# EAGLE design hamp2 (EAGLE 6.1)
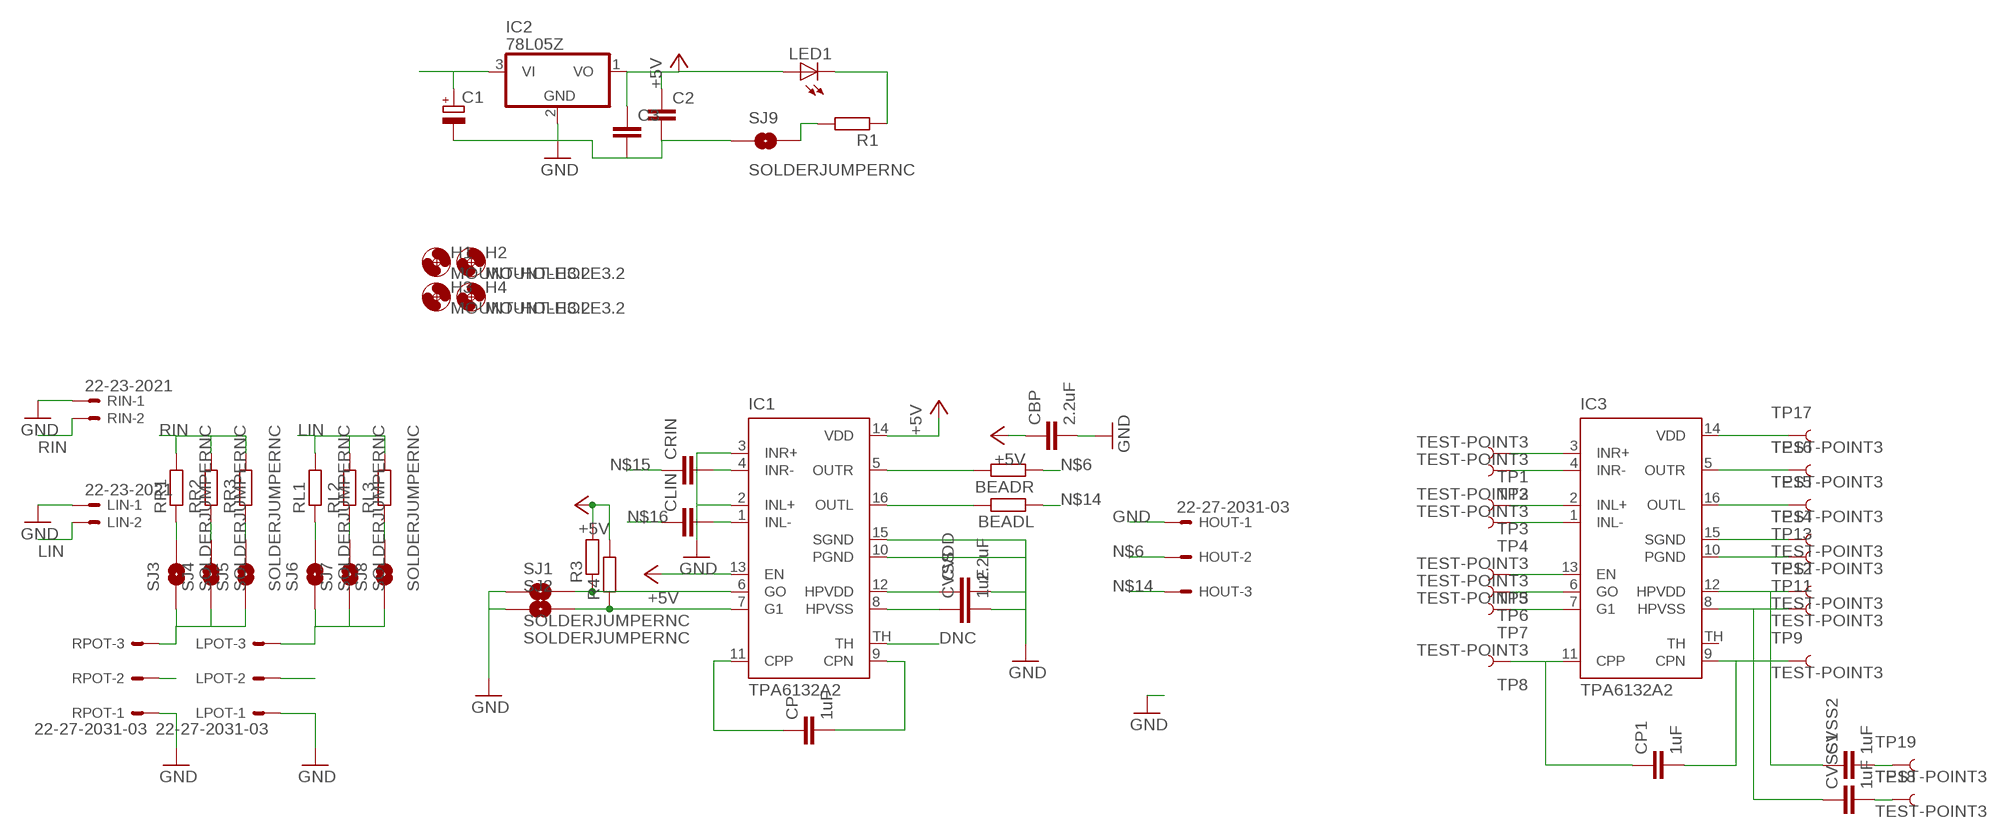
[diagram p0: schematic, sheet 1]

## Parts
BEADL  R-EU_R0805  [R0805]
BEADR  R-EU_R0805  [R0805]
C1  CPOL-EUF  [PANASONIC_F]
C2  C-EUC1210  [C1210]
C3  C-EUC0805  [C0805]
CBP  2.2uF  C-EUC0805  [C0805]
CLIN  C-EU050-055X075  [C050-055X075]
CP  1uF  C-EUC0805  [C0805]
CP1  1uF  C-EUC0805  [C0805]
CRIN  C-EU050-055X075  [C050-055X075]
CVDD  2.2uF  C-EUC0805  [C0805]
CVSS  1uF  C-EUC0805  [C0805]
CVSS1  1uF  C-EUC0805  [C0805]
CVSS2  1uF  C-EUC0805  [C0805]
H1  MOUNT-HOLE3.2  [3,2]
H2  MOUNT-HOLE3.2  [3,2]
H3  MOUNT-HOLE3.2  [3,2]
H4  MOUNT-HOLE3.2  [3,2]
HOUT  22-27-2031-03  [6410-03]
IC1  TPA6132A2  [QFN16]
IC2  78L05Z  [TO92]
IC3  TPA6132A2  [QFN16]
LED1  LEDCHIP-LED0805  [CHIP-LED0805]
LIN  22-23-2021  [22-23-2021]
LPOT  22-27-2031-03  [6410-03]
R1  R-EU_R0805  [R0805]
R3  R-EU_R0805  [R0805]
R4  R-EU_R0805  [R0805]
RIN  22-23-2021  [22-23-2021]
RL1  R-EU_R0805  [R0805]
RL2  R-EU_R0805  [R0805]
RL3  R-EU_R0805  [R0805]
RPOT  22-27-2031-03  [6410-03]
RR1  R-EU_R0805  [R0805]
RR2  R-EU_R0805  [R0805]
RR3  R-EU_R0805  [R0805]
SJ1  SOLDERJUMPERNC  [SJ_2S]
SJ2  SOLDERJUMPERNC  [SJ_2S]
SJ3  SOLDERJUMPERNC  [SJ_2S]
SJ4  SOLDERJUMPERNC  [SJ_2S]
SJ5  SOLDERJUMPERNC  [SJ_2S]
SJ6  SOLDERJUMPERNC  [SJ_2S]
SJ7  SOLDERJUMPERNC  [SJ_2S]
SJ8  SOLDERJUMPERNC  [SJ_2S]
SJ9  SOLDERJUMPERNC  [SJ_2S]
TP1  TEST-POINT3  [PAD.03X.03]
TP2  TEST-POINT3  [PAD.03X.03]
TP3  TEST-POINT3  [PAD.03X.03]
TP4  TEST-POINT3  [PAD.03X.03]
TP5  TEST-POINT3  [PAD.03X.03]
TP6  TEST-POINT3  [PAD.03X.03]
TP7  TEST-POINT3  [PAD.03X.03]
TP8  TEST-POINT3  [PAD.03X.03]
TP9  TEST-POINT3  [PAD.03X.03]
TP11  TEST-POINT3  [PAD.03X.03]
TP12  TEST-POINT3  [PAD.03X.03]
TP13  TEST-POINT3  [PAD.03X.03]
TP14  TEST-POINT3  [PAD.03X.03]
TP15  TEST-POINT3  [PAD.03X.03]
TP16  TEST-POINT3  [PAD.03X.03]
TP17  TEST-POINT3  [PAD.03X.03]
TP18  TEST-POINT3  [PAD.03X.03]
TP19  TEST-POINT3  [PAD.03X.03]

## Nets
+5V: C2.1 C3.1 CBP.1 IC1.13(EN) IC1.14(VDD) IC2.1(VO) LED1.A R3.2 R4.2
DNC: IC1.TH
GND: C1.- C2.2 C3.2 CBP.2 CVDD.2 CVSS.2 HOUT.1 IC1.2(INL+) IC1.3(INR+) IC1.10(PGND) IC1.15(SGND) IC2.2(GND) LIN.1 LPOT.1 RIN.1 RPOT.1 SJ1.1 SJ2.1 SJ9.1
LIN: LIN.2 RL1.2 RL2.2 RL3.2
N$1: CVDD.1 IC1.12(HPVDD)
N$2: CRIN.2 IC1.4(INR-)
N$3: CLIN.2 IC1.1(INL-)
N$4: IC1.6(GO) R3.1 SJ1.2
N$5: IC1.7(G1) R4.1 SJ2.2
N$6: BEADR.1 HOUT.2
N$7: CP.1 IC1.11(CPP)
N$8: CP.2 IC1.9(CPN)
N$9: CVSS.1 IC1.8(HPVSS)
N$10: BEADR.2 IC1.5(OUTR)
N$11: BEADL.2 IC1.16(OUTL)
N$12: RR1.1 SJ3.2
N$13: RR2.1 SJ4.2
N$14: BEADL.1 HOUT.3
N$15: CRIN.1 RPOT.2 RR3.1 SJ5.2
N$16: CLIN.1 LPOT.2 RL3.1 SJ8.2
N$17: C1.+ IC2.3(VI)
N$18: RL1.1 SJ6.2
N$19: RL2.1 SJ7.2
N$20: RPOT.3 SJ3.1 SJ4.1 SJ5.1
N$21: LPOT.3 SJ6.1 SJ7.1 SJ8.1
N$22: IC3.3(INR+) TP1.P$1
N$23: IC3.4(INR-) TP2.P$1
N$24: IC3.2(INL+) TP3.P$1
N$25: IC3.1(INL-) TP4.P$1
N$26: IC3.13(EN) TP5.P$1
N$27: IC3.6(GO) TP6.P$1
N$28: IC3.7(G1) TP7.P$1
N$29: CP1.1 IC3.11(CPP) TP8.P$1
N$30: CP1.2 IC3.9(CPN) TP9.P$1
N$31: LED1.C R1.1
N$32: CVSS1.1 IC3.8(HPVSS) TP11.P$1
N$33: CVSS2.1 IC3.12(HPVDD) TP12.P$1
N$34: IC3.10(PGND) TP13.P$1
N$35: IC3.15(SGND) TP14.P$1
N$36: IC3.16(OUTL) TP15.P$1
N$37: IC3.5(OUTR) TP16.P$1
N$38: IC3.14(VDD) TP17.P$1
N$39: CVSS2.2 TP19.P$1
N$40: CVSS1.2 TP18.P$1
N$41: R1.2 SJ9.2
RIN: RIN.2 RR1.2 RR2.2 RR3.2
Unconnected: IC3.TH

## Library data of the parts
BEADL BEADR R1 R3 R4 RL1-RL3 RR1-RR3 = rcl:R-EU_: RESISTOR, European symbol
C1 = rcl:CPOL-EU: POLARIZED CAPACITOR, European symbol
C2 C3 CBP CP CP1 CVDD CVSS CVSS1 CVSS2 = resistor:C-EU: CAPACITOR, European symbol
CLIN CRIN = rcl:C-EU: CAPACITOR, European symbol
H1-H4 = holes:MOUNT-HOLE: MOUNTING HOLE with drill center marker
HOUT LPOT RPOT = con-molex:22-?-03: CONNECTOR wire to board 2.54 mm (.1 inch) pitch header; OC_FARNELL: unknown; OC_NEWARK: unknown
IC1 IC3 = texas:TPA6132A2: 25-mW DIRECTPATH (TM) STEREO HEADPHONE AMPLIFIER WITH POP SUPPRESSION Source: www.ti.com .. tpa6132a2 direct path stereo $.65.pdf; MPN: TPA6132A2RTET; OC_FARNELL: 1697167; OC_NEWARK: 46P3781
IC2 = adafruit:78*: Positive VOLTAGE REGULATOR Added bigger pads to the TO-92 package
LED1 = adafruit:LED: LED OSRAM: - CHIPLED LG R971, LG N971, LY N971, LG Q971, LY Q971, LO R971, LY R971 LH N974, LH R974 LS Q976, LO Q976, LY Q976 LO Q996 - Hyper CHIPLED LW Q18S LB Q993, LB Q99A, LB R99A - SideLED LS A670, LO A670, LY A670, LG A670, LP A670 LB A673, LV A673, LT A673, LW A673 LH A674 LY A675 LS A676, LA A676, LO A676, LY A676, LW A676 LS A679, LY A679, LG A679 - Hyper Micro SIDELED® LS Y876, LA Y876, LO Y876, LY Y876 LT Y87S - SmartLED LW L88C, LW L88S LB L89C, LB L89S, LG L890 LS L89K, LO L89K, LY L89K LS L896, LA L896, LO L896, LY L896 - TOPLED LS T670, LO T670, LY T670, LG T670, LP T670 LSG T670, LSP T670, LSY T670, LOP T670, LYG T670 LG T671, LOG T671, LSG T671 LB T673, LV T673, LT T673, LW T673 LH T674 LS T676, LA T676, LO T676, LY T676, LB T676, LH T676, LSB T676, LW T676 LB T67C, LV T67C, LT T67C, LS T67K, LO T67K, LY T67K, LW E67C LS E67B, LA E67B, LO E67B, LY E67B, LB E67C, LV E67C, LT E67C LW T67C LS T679, LY T679, LG T679 LS T770, LO T770, LY T770, LG T770, LP T770 LB T773, LV T773, LT T773, LW T773 LH T774 LS E675, LA E675, LY E675, LS T675 LS T776, LA T776, LO T776, LY T776, LB T776 LHGB T686 LT T68C, LB T68C - Hyper Mini TOPLED® LB M676 - Mini TOPLED Santana® LG M470 LS M47K, LO M47K, LY M47K Source: http://www.osram.convergy.de/
LIN RIN = con-molex:22-23-2021: .100" (2.54mm) Center Header - 2 Pin; MF: MOLEX; MPN: 22-23-2021; OC_FARNELL: 1462926; OC_NEWARK: 25C3832
SJ1-SJ9 = SparkFun-Passives:SOLDERJUMPER: Solder Jumper Standard SMD solder jumper. Used to automate production. Two varients : Normally Open and Normally Closed are the same, but have different paste layers. NC will have a large amount of paste and should jumper during reflow.
TP1-TP9 TP11-TP19 = SparkFun-Passives:TEST-POINT: Bare copper test points for troubleshooting or ICT

## Board
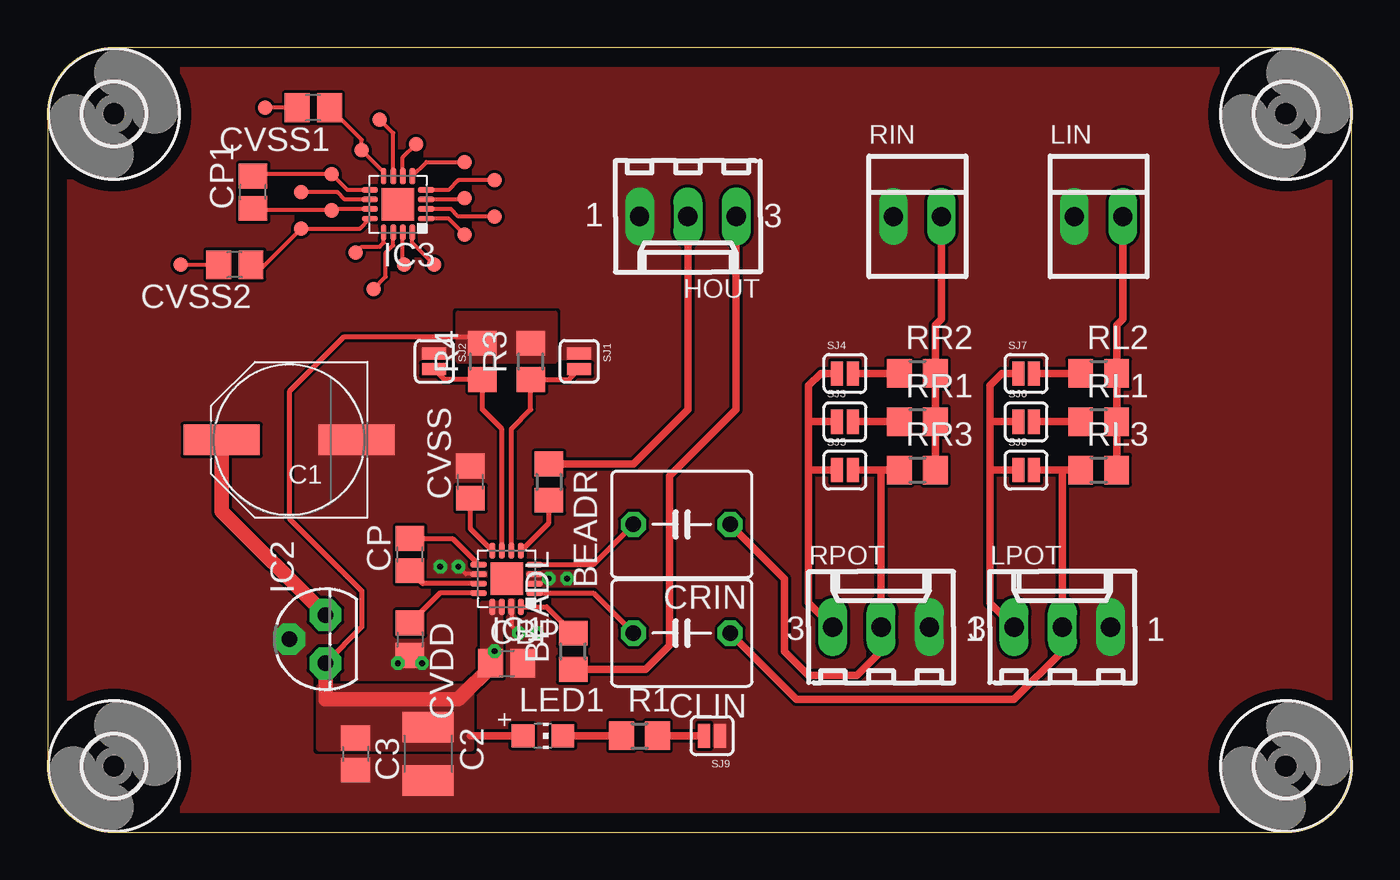
[diagram p1: board, top side]
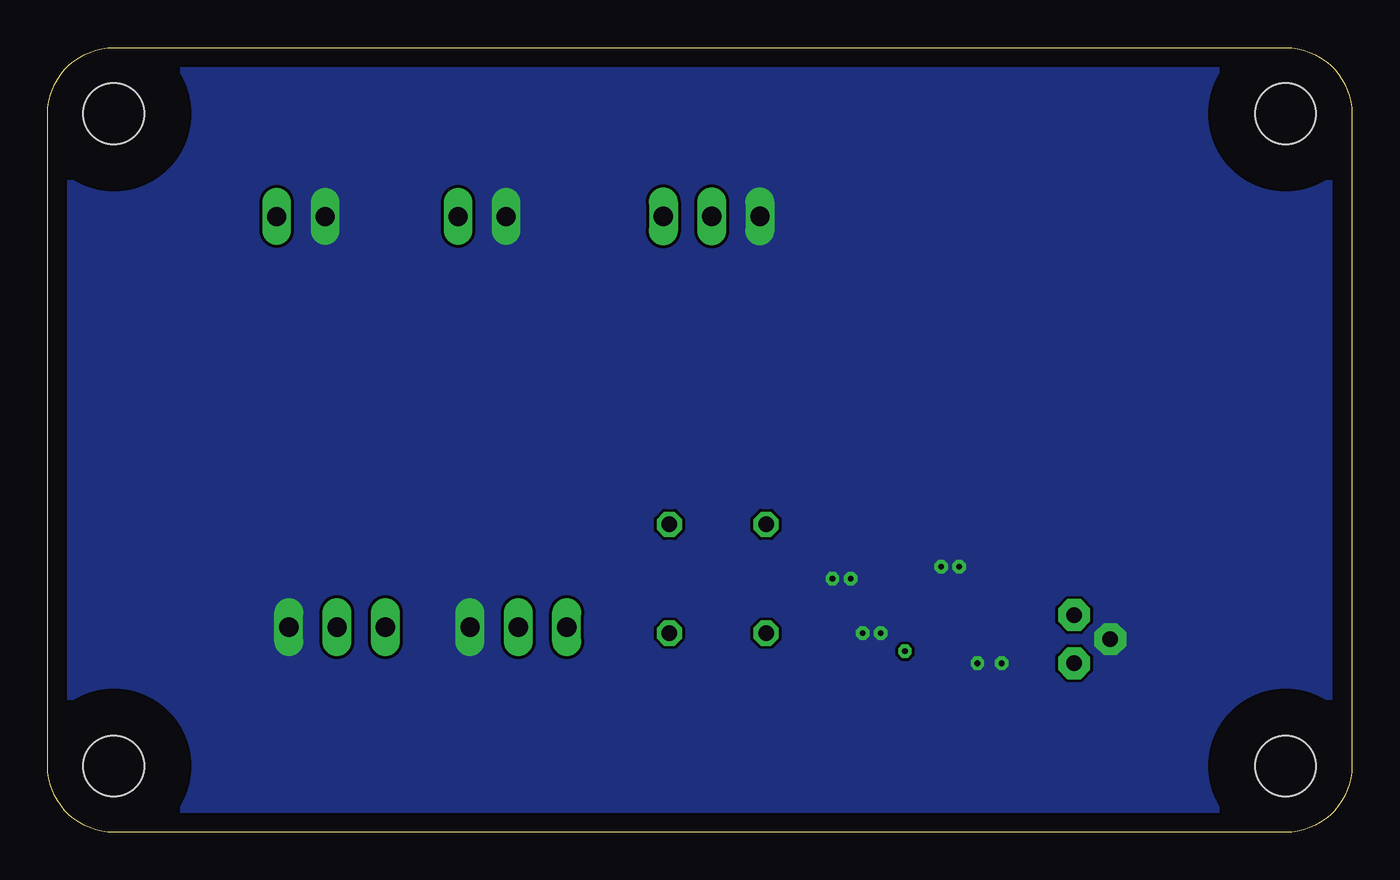
[diagram p2: board, bottom side, seen from below]

Size 68.56 x 41.26 mm. Coordinates in mm from the lower left corner, seen from the top.
Outline: 0,37.77 0,3.49 arc90 3.49,0 65.07,0 arc90 68.56,3.49 68.56,37.77 arc90 65.07,41.26 3.49,41.26 arc90 0,37.77
Copper layers (1*16): Top 0.035mm / dielectric 1.5mm / Bottom 0.035mm
Design rules: minimum track width 8mil, minimum drill 0.3mm, track to track 6mil, track to pad 6mil, pad to pad 6mil, via to via 6mil, smd to smd 0mil, copper to edge 40mil, drill to drill 8mil, minimum pad ring 10mil, minimum via ring 8mil, stop-mask expansion 4mil, vias tented up to drill 0mil, thermal gap 10mil

### Footprints (pad centres in the part's own frame; a part is rotated, then mirrored left to right if it is on the bottom)
R0805 = smd 1.3 x 1.5: 1 -0.95,0; 2 0.95,0
PANASONIC_F = smd 4 x 1.6: + 3.55,0; - -3.55,0
C1210 = smd 1.6 x 2.7: 1 -1.4,0; 2 1.4,0
C0805 = smd 1.3 x 1.5: 1 -0.85,0; 2 0.85,0
C050-055X075 = drill 0.813 octagon: 1 -2.54,0; 2 2.54,0
3,2 = hole 3.2: 0,0
6410-03 = drill 1.016 long: 1 2.54,0; 2 0,0; 3 -2.54,0
QFN16 = smd 0.85 x 0.3: 1 -1.475,0.75; 2 -1.475,0.25; 3 -1.475,-0.25; 4 -1.475,-0.75; 9 1.475,-0.75; 10 1.475,-0.25; 11 1.475,0.25; 12 1.475,0.75 | smd 0.3 x 0.85: 5 -0.75,-1.475; 6 -0.25,-1.475; 7 0.25,-1.475; 8 0.75,-1.475; 13 0.75,1.475; 14 0.25,1.475; 15 -0.25,1.475; 16 -0.75,1.475 | smd 1.7 x 1.7: TH 0,0
TO92 = drill 0.813 pad 1.676 octagon: 1 -1.27,0; 2 0,1.905; 3 1.27,0
CHIP-LED0805 = smd 1.2 x 1.2: A 0,-1.05; C 0,1.05
22-23-2021 = drill 1 long: 1 -1.27,0; 2 1.27,0
SJ_2S = smd 0.635 x 1.27: 1 -0.412,0; 2 0.412,0
PAD.03X.03 = smd 0.762 x 0.762: P$1 0,0

### Placement (x,y rotation side)
BEADL  27.62,9.53 90 top
BEADR  26.35,18.41 270 top
C1  12.7,20.64 180 top
C2  20,4.13 270 top
C3  16.19,4.13 270 top
CBP  24.13,8.89 0 top
CLIN  33.34,10.48 180 top
CP  19.05,14.61 90 top
CP1  10.79,33.66 90 top
CRIN  33.34,16.19 180 top
CVDD  19.05,10.16 270 top
CVSS  22.23,18.41 90 top
CVSS1  13.97,38.1 180 top
CVSS2  9.84,29.84 180 top
H1  3.49,3.49 0 top
H2  3.49,37.78 0 top
H3  65.09,3.49 0 top
H4  65.09,37.78 0 top
HOUT  33.66,32.38 180 top
IC1  24.13,13.34 180 top
IC2  14.61,10.16 90 top
IC3  18.41,33.02 180 top
LED1  26.04,5.08 270 top
LIN  55.24,32.38 0 top
LPOT  53.34,10.79 0 top
R1  31.11,5.08 0 top
R3  25.4,24.77 90 top
R4  22.86,24.77 90 top
RIN  45.72,32.38 0 top
RL1  55.24,21.59 0 top
RL2  55.24,24.13 0 top
RL3  55.24,19.05 0 top
RPOT  43.81,10.79 0 top
RR1  45.72,21.59 0 top
RR2  45.72,24.13 0 top
RR3  45.72,19.05 0 top
SJ1  27.94,24.77 270 top
SJ2  20.32,24.77 270 top
SJ3  41.91,21.59 0 top
SJ4  41.91,24.13 0 top
SJ5  41.91,19.05 0 top
SJ6  51.44,21.59 0 top
SJ7  51.44,24.13 0 top
SJ8  51.44,19.05 0 top
SJ9  34.92,5.08 180 top
TP1  21.91,33.34 90 top
TP2  23.5,34.29 90 top
TP3  23.5,32.38 90 top
TP4  21.91,31.43 90 top
TP5  16.19,30.48 90 top
TP6  19.37,36.2 90 top
TP7  17.46,37.47 90 top
TP8  14.92,32.7 90 top
TP9  14.92,34.61 90 top
TP11  16.51,35.88 90 top
TP12  13.34,31.75 90 top
TP13  13.34,33.66 90 top
TP14  18.73,29.84 90 top
TP15  20.32,29.84 90 top
TP16  21.91,35.24 90 top
TP17  17.14,28.57 90 top
TP18  11.43,38.1 90 top
TP19  6.99,29.84 90 top

### Tracks (layer width: path | path; a pad name or v marks a point on that pad's centre or on a via)
+5V  (via drill 0.3)
  Top 0.254: R4.2 22.86,26.04 15.56,26.04 12.7,23.18 12.7,16.51 16.51,12.7 16.51,10.79 IC2.1
  Top 0.406: LED1.A 22.23,5.08
  Top 0.762: IC2.1 14.61,6.99 21.59,6.99 23.5,8.89
  other vias: 23.5,9.53
  pour Top (no thermals): 23.81,12.06 23.81,8.26 22.86,8.26 22.86,12.06
  pour Top (no thermals): 21.59,27.3 26.67,27.3 26.67,24.77 21.59,24.77
  pour Top (no thermals): 14.29,7.62 22.23,7.62 22.23,4.45 14.29,4.45
GND  (via drill 0.3)
  Top 0.203: IC1.10 21.98,13.59 v21.59,13.97 | IC1.15 24.38,10.86 v24.77,10.48
  other vias: 20.64,13.97 27.3,13.34 26.35,13.34 25.72,10.48 19.68,8.89 18.41,8.89
  pour Top (rank 3, no thermals): 0.64,40.64 67.94,40.64 67.94,0.64 0.64,0.64
  pour Bottom (no thermals): 0.64,41.27 67.94,41.27 67.94,0.64 0.64,0.64
LIN
  Top 0.406: LIN.2 56.52,26.99 56.2,26.67 RL2.2 | RL3.2 RL2.2 | RL2.2 RL1.2
N$1
  Top 0.254: IC1.12 20.62,12.59 CVDD.1
N$2
  Top 0.254: IC1.4 28.69,14.09 CRIN.2
N$3
  Top 0.254: IC1.1 28.69,12.59 CLIN.2
N$4
  Top 0.254: IC1.6 24.38,21.2 25.4,22.23 R3.1 27.4,23.82 SJ1.2
N$5
  Top 0.254: IC1.7 23.88,21.2 22.86,22.23 R4.1 20.86,23.82 SJ2.2
N$6
  Top 0.406: BEADR.1 30.8,19.36 33.66,22.23 HOUT.2
N$7
  Top 0.254: IC1.11 19.72,13.09 CP.1
N$8
  Top 0.254: CP.2 21.29,15.46 IC1.9
N$9
  Top 0.254: IC1.8 22.23,15.96 CVSS.1
N$10
  Top 0.254: IC1.5 26.35,16.28 BEADR.2
N$11
  Top 0.254: IC1.16 26.24,11.86 BEADL.2
N$12
  Top 0.406: RR1.1 SJ3.2
N$13
  Top 0.406: RR2.1 SJ4.2
N$14
  Top 0.406: BEADL.1 31.43,8.57 32.7,9.84 32.7,18.73 36.2,22.23 HOUT.3
N$15
  Top 0.406: RR3.1 43.81,19.05 | 43.81,19.05 SJ5.2 | 43.81,19.05 RPOT.2 43.81,9.53 42.55,8.26 40.01,8.26 38.73,9.53 38.73,13.34 CRIN.1
N$16
  Top 0.406: RL3.1 53.34,19.05 | 53.34,19.05 SJ8.2 | 53.34,19.05 LPOT.2 53.34,9.53 50.8,6.99 39.37,6.99 CLIN.1
N$17
  Top 0.762: C1.+ 9.15,16.89 IC2.3
N$18
  Top 0.406: RL1.1 SJ6.2
N$19
  Top 0.406: RL2.1 SJ7.2
N$20
  Top 0.406: SJ4.1 40.64,24.13 40.01,23.5 40.01,21.59 | 40.01,21.59 40.01,19.05 | SJ3.1 40.01,21.59 | SJ5.1 40.01,19.05 | RPOT.3 40.01,12.06 40.01,19.05
N$21
  Top 0.406: SJ7.1 50.16,24.13 49.53,23.5 49.53,21.59 | 49.53,21.59 49.53,19.05 | SJ6.1 49.53,21.59 | SJ8.1 49.53,19.05 | LPOT.3 49.53,12.06 49.53,19.05
N$22
  Top 0.203: TP1.P$1 21.84,33.27 IC3.3
N$23
  Top 0.203: TP2.P$1 21.59,34.29 21.07,33.77 IC3.4
N$24
  Top 0.203: TP3.P$1 21.59,32.38 21.2,32.77 IC3.2
N$25
  Top 0.203: TP4.P$1 21.07,32.27 IC3.1
N$26
  Top 0.203: TP5.P$1 16.51,30.8 17.46,30.8 17.66,31 IC3.13
N$27
  Top 0.203: IC3.6 18.66,35.49 TP6.P$1
N$28
  Top 0.203: IC3.7 18.16,36.76 TP7.P$1
N$29
  Top 0.203: IC3.11 14.99,32.77 TP8.P$1 10.9,32.7 CP1.1
N$30
  Top 0.203: IC3.9 15.76,33.77 TP9.P$1 10.9,34.61 CP1.2
N$31
  Top 0.406: R1.1 LED1.C
N$32
  Top 0.203: IC3.8 17.66,34.72 TP11.P$1 16.51,36.41 CVSS1.1
N$33
  Top 0.203: IC3.12 16.42,31.75 TP12.P$1 11.33,29.74 CVSS2.1
N$34
  Top 0.203: IC3.10 15.62,33.27 15.24,33.66 TP13.P$1
N$35
  Top 0.203: TP14.P$1 18.66,29.91 IC3.15
N$36
  Top 0.203: TP15.P$1 19.16,31 IC3.16
N$37
  Top 0.203: IC3.5 19.91,35.24 TP16.P$1
N$38
  Top 0.203: TP17.P$1 17.78,29.21 17.78,30.48 18.16,30.86 IC3.14
N$39
  Top 0.203: TP19.P$1 CVSS2.2
N$40
  Top 0.203: CVSS1.2 TP18.P$1
N$41
  Top 0.406: SJ9.2 R1.2
RIN
  Top 0.406: RIN.2 46.99,26.99 46.67,26.67 RR2.2 | RR2.2 RR3.2 | RR1.2 RR2.2